# Altium schematic sheet schematic.schdoc
size 309 x 223 mm; Symbol: Sheet-Symbol_A4; Device: Sheet-Symbol_A4; @Project Name: Mt6701_V4; @Page Count: 1; @Update Date: 2024-07-19; @Create Date: 2024-07-19; @Schematic Name: Schematic1; @Page No: 1; @Page Name: P1; Company: EasyEDA.com; Reviewed: EasyEDA; Version: V0.1; Page Size: A4; Part Number: JLCPCB-002; Drawn: EasyEDA
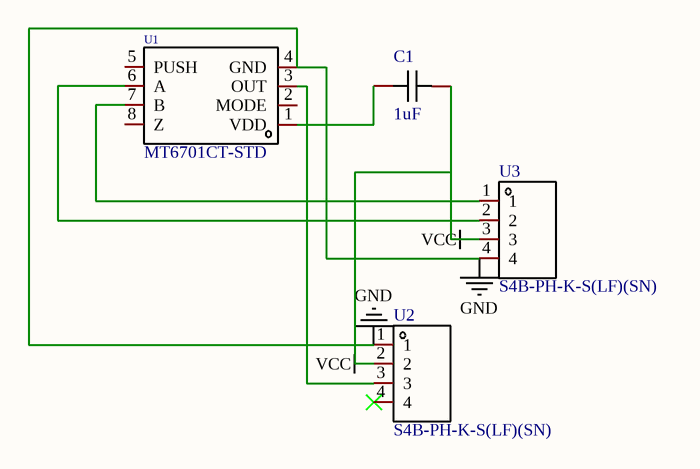
[diagram p0: schematic.schdoc]

## Parts
C1  1uF  [C0603]
U1  MT6701CT-STD  [SOP-8_L4.9-W3.9-P1.27-LS6.0-BL]
U2  S4B-PH-K-S(LF)(SN)  [CONN-TH_4P-P2.00_S4B-PH-K-S-LF-SN]
U3  S4B-PH-K-S(LF)(SN)  [CONN-TH_4P-P2.00_S4B-PH-K-S-LF-SN]

## Nets
GND: U1.4(GND) U2.1 U3.4
VCC: C1.2 U2.2 U3.3
NetC1_1: C1.1 U1.1(VDD)
NetU1_3: U1.3(OUT) U2.3
NetU1_6: U1.6(A) U3.2
NetU1_7: U1.7(B) U3.1

Not connected (* = marked no-connect by the designer): U1 2(MODE) 5(PUSH) 8(Z); U2 4*

## Notes on the sheet
- 1
- 2
- 3
- 4
- 5
- 6
- A
- B
- C
- Schematic
- Schematic1
- Create Date
- Update Date
- 2024-07-19
- Reviewed
- Drawn
- Page
- EasyEDA
- P1
- Part Number
- Mt6701_V4
- JLCPCB-002
- D
- VER
- SIZE
- PAGE
- OF
- V0.1
- A4
- EasyEDA.com

## Library data of the parts
C1 = CAP_0603: Symbol: CAP; Convert to PCB: yes; Name: 1uF; Device: CAP_0603; Add into BOM: yes; Supplier Footprint: 0603; Value: 1uF
U1 = MT6701CT-STD: Manufacturer: MagnTek(麦歌恩); Add into BOM: yes; Name: MT6701CT-STD; Symbol: MT6701CT-STD; Device: MT6701CT-STD; Supplier: LCSC; Supplier Part: C2856764; Manufacturer Part: MT6701CT-STD; JLCPCB Part Class: Extended Part; LCSC Part Name: 霍尔在线编程角度位置传感器; Supplier Footprint: SOP-8; Datasheet: https://atta.szlcsc.com/upload/public/pdf/source/20210901/89396AA55DF26524CEF7734A3D9C2FB3.pdf; Convert to PCB: yes
U2 U3 = S4B-PH-K-S(LF)(SN): Manufacturer: JST; Symbol: S4B-PH-K-S-(LF)(SN); Add into BOM: yes; Pins Structure: 1x4P; Pitch: 2mm; Reference Series: PH; Number of PINs Per Row: 4; Current Rating (Max): 2A; Rated Voltage (Max): 100V; Plastic Material: PA66; Flame Retardant Rating: UL94V-0; Supplementary Features: 打K脚; Z-Height of the Board: 4.8mm; X-Length of Bottom Edge on Board (Spacing Line): 9.9mm; Y-Width of Bottom Edge on Board: 7.6mm; Description: Pins Structure:1x4P Pitch:2mm Mounting Style:Right-Angle Reference Series:PH Number of Pins:4P Number of Rows:1 Number of PINs Per Row:4 Row Spacing:- Current Rating (Max):2A Contact Material:Brass Contact Plating:Tin Operating Temperature Range:-25℃~+85℃; Name: S4B-PH-K-S(LF)(SN); Device: S4B-PH-K-S(LF)(SN); LCSC Part Name: 1x4P 间距:2mm 弯插 系列:PH; Supplier Part: C157926; Manufacturer Part: S4B-PH-K-S(LF)(SN); Supplier Footprint: 弯插,P=2mm; JLCPCB Part Class: Extended Part; Datasheet: https://atta.szlcsc.com/upload/public/pdf/source/20181010/C265101_22107ACC4D8714694FDA2DD97145FA81.pdf; Supplier: LCSC; Convert to PCB: yes; Mounting Style: Right-Angle; Number of Pins: 4P; Number of Rows: 1; Row Spacing: -; Contact Material: Brass; Contact Plating: Tin; Operating Temperature Range: -25℃~+85℃; Colour: White